# Altium project zynqEXP.PrjPCB
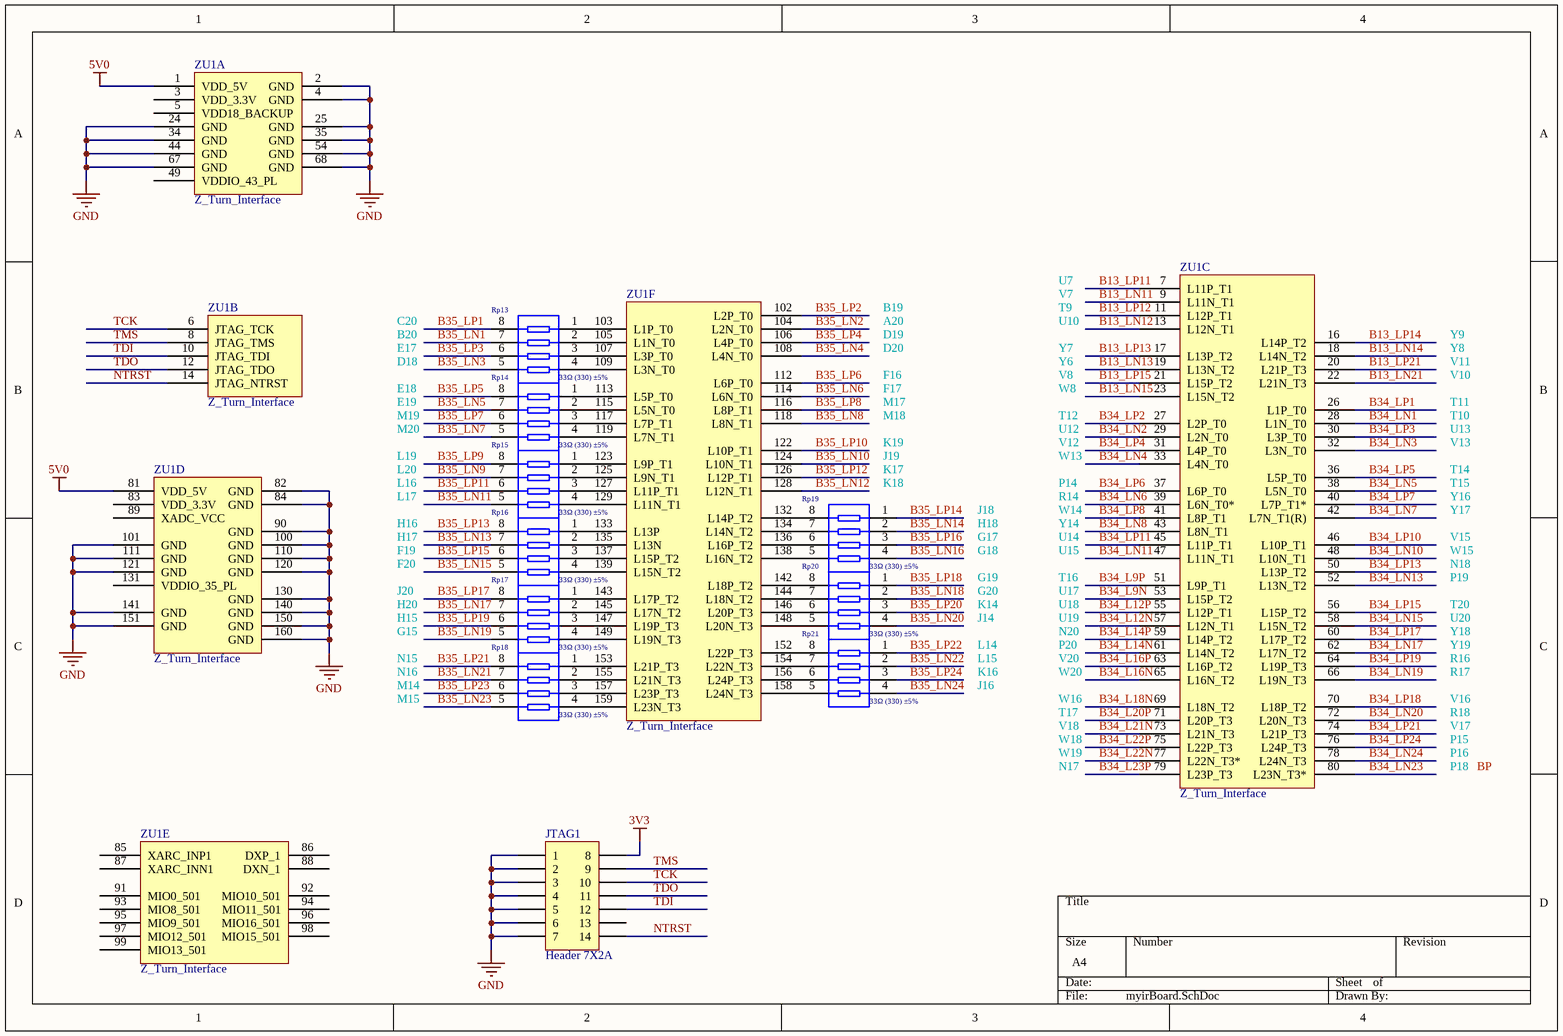
[diagram p0: myirBoard.SchDoc]
6 sheets, 92 parts. Net scope: global (net labels, ports and power ports of the same name join across sheets).
Board file: zynqEXP.PcbDoc
Sheets:
  zynqEXP.SchDoc
  myirBoard.SchDoc
  stepper.SchDoc
  protecter.SchDoc
  assistPower.SchDoc
  ITAC.SchDoc

## Sheet zynqEXP.SchDoc
size A4

## Sheet myirBoard.SchDoc
size A4

### Parts
JTAG1  Header 7X2A  [HDR2X7_CEN]
Rp13  33Ω (330) ±5%  [0402_Rx4]
Rp14  33Ω (330) ±5%  [0402_Rx4]
Rp15  33Ω (330) ±5%  [0402_Rx4]
Rp16  33Ω (330) ±5%  [0402_Rx4]
Rp17  33Ω (330) ±5%  [0402_Rx4]
Rp18  33Ω (330) ±5%  [0402_Rx4]
Rp19  33Ω (330) ±5%  [0402_Rx4]
Rp20  33Ω (330) ±5%  [0402_Rx4]
Rp21  33Ω (330) ±5%  [0402_Rx4]
ZU1  Z_Turn_Interface  [ZTURN]  (parts A,B,C,D,E,F of 6)

### Nets
3V3: JTAG1.8
5V0: ZU1.1(VDD_5V) ZU1.81(VDD_5V)
GND: JTAG1.1 JTAG1.2 JTAG1.3 JTAG1.4 JTAG1.5 JTAG1.6 JTAG1.7 ZU1.2(GND) ZU1.4(GND) ZU1.24(GND) ZU1.25(GND) ZU1.34(GND) ZU1.35(GND) ZU1.44(GND) ZU1.54(GND) ZU1.67(GND) ZU1.68(GND) ZU1.82(GND) ZU1.84(GND) ZU1.90(GND) ZU1.100(GND) ZU1.101(GND) ZU1.110(GND) ZU1.111(GND) ZU1.120(GND) ZU1.121(GND) ZU1.130(GND) ZU1.140(GND) ZU1.141(GND) ZU1.150(GND) ZU1.151(GND) ZU1.160(GND)
B13_LN11: ZU1.9(L11N_T1)
B13_LN12: ZU1.13(L12N_T1)
B13_LN13: ZU1.19(L13N_T2)
B13_LN14: ZU1.18(L14N_T2)
B13_LN15: ZU1.23(L15N_T2)
B13_LN21: ZU1.22(L21N_T3)
B13_LP11: ZU1.7(L11P_T1)
B13_LP12: ZU1.11(L12P_T1)
B13_LP13: ZU1.17(L13P_T2)
B13_LP14: ZU1.16(L14P_T2)
B13_LP15: ZU1.21(L15P_T2)
B13_LP21: ZU1.20(L21P_T3)
B34_L9N: ZU1.53(L15P_T2)
B34_L9P: ZU1.51(L9P_T1)
B34_L12N: ZU1.57(L12N_T1)
B34_L12P: ZU1.55(L12P_T1)
B34_L14N: ZU1.61(L14N_T2)
B34_L14P: ZU1.59(L14P_T2)
B34_L16N: ZU1.65(L16N_T2)
B34_L16P: ZU1.63(L16P_T2)
B34_L18N: ZU1.69(L18N_T2)
B34_L20P: ZU1.71(L20P_T3)
B34_L21N: ZU1.73(L21N_T3)
B34_L22N: ZU1.77(L22N_T3*)
B34_L22P: ZU1.75(L22P_T3)
B34_L23P: ZU1.79(L23P_T3)
B34_LN1: ZU1.28(L1N_T0)
B34_LN2: ZU1.29(L2N_T0)
B34_LN3: ZU1.32(L3N_T0)
B34_LN4: ZU1.33(L4N_T0)
B34_LN5: ZU1.38(L5N_T0)
B34_LN6: ZU1.39(L6N_T0*)
B34_LN7: ZU1.42(L7N_T1(R))
B34_LN8: ZU1.43(L8N_T1)
B34_LN10: ZU1.48(L10N_T1)
B34_LN11: ZU1.47(L11N_T1)
B34_LN13: ZU1.52(L13N_T2)
B34_LN15: ZU1.58(L15N_T2)
B34_LN17: ZU1.62(L17N_T2)
B34_LN19: ZU1.66(L19N_T3)
B34_LN20: ZU1.72(L20N_T3)
B34_LN23: ZU1.80(L23N_T3*)
B34_LN24: ZU1.78(L24N_T3)
B34_LP1: ZU1.26(L1P_T0)
B34_LP2: ZU1.27(L2P_T0)
B34_LP3: ZU1.30(L3P_T0)
B34_LP4: ZU1.31(L4P_T0)
B34_LP5: ZU1.36(L5P_T0)
B34_LP6: ZU1.37(L6P_T0)
B34_LP7: ZU1.40(L7P_T1*)
B34_LP8: ZU1.41(L8P_T1)
B34_LP10: ZU1.46(L10P_T1)
B34_LP11: ZU1.45(L11P_T1)
B34_LP13: ZU1.50(L13P_T2)
B34_LP15: ZU1.56(L15P_T2)
B34_LP17: ZU1.60(L17P_T2)
B34_LP18: ZU1.70(L18P_T2)
B34_LP19: ZU1.64(L19P_T3)
B34_LP21: ZU1.74(L21P_T3)
B34_LP24: ZU1.76(L24P_T3)
B35_LN1: Rp13.7
B35_LN2: ZU1.104(L2N_T0)
B35_LN3: Rp13.5
B35_LN4: ZU1.108(L4N_T0)
B35_LN5: Rp14.7
B35_LN6: ZU1.114(L6N_T0)
B35_LN7: Rp14.5
B35_LN8: ZU1.118(L8N_T1)
B35_LN9: Rp15.7
B35_LN10: ZU1.124(L10N_T1)
B35_LN11: Rp15.5
B35_LN12: ZU1.128(L12N_T1)
B35_LN13: Rp16.7
B35_LN14: Rp19.2
B35_LN15: Rp16.5
B35_LN16: Rp19.4
B35_LN17: Rp17.7
B35_LN18: Rp20.2
B35_LN19: Rp17.5
B35_LN20: Rp20.4
B35_LN21: Rp18.7
B35_LN22: Rp21.2
B35_LN23: Rp18.5
B35_LN24: Rp21.4
B35_LP1: Rp13.8
B35_LP2: ZU1.102(L2P_T0)
B35_LP3: Rp13.6
B35_LP4: ZU1.106(L4P_T0)
B35_LP5: Rp14.8
B35_LP6: ZU1.112(L6P_T0)
B35_LP7: Rp14.6
B35_LP8: ZU1.116(L8P_T1)
B35_LP9: Rp15.8
B35_LP10: ZU1.122(L10P_T1)
B35_LP11: Rp15.6
B35_LP12: ZU1.126(L12P_T1)
B35_LP13: Rp16.8
B35_LP14: Rp19.1
B35_LP15: Rp16.6
B35_LP16: Rp19.3
B35_LP17: Rp17.8
B35_LP18: Rp20.1
B35_LP19: Rp17.6
B35_LP20: Rp20.3
B35_LP21: Rp18.8
B35_LP22: Rp21.1
B35_LP23: Rp18.6
B35_LP24: Rp21.3
NTRST: JTAG1.14 ZU1.14(JTAG_NTRST)
TCK: JTAG1.10 ZU1.6(JTAG_TCK)
TDI: JTAG1.12 ZU1.10(JTAG_TDI)
TDO: JTAG1.11 ZU1.12(JTAG_TDO)
TMS: JTAG1.9 ZU1.8(JTAG_TMS)
NetRp13_1: Rp13.1 ZU1.103(L1P_T0)
NetRp13_2: Rp13.2 ZU1.105(L1N_T0)
NetRp13_3: Rp13.3 ZU1.107(L3P_T0)
NetRp13_4: Rp13.4 ZU1.109(L3N_T0)
NetRp14_1: Rp14.1 ZU1.113(L5P_T0)
NetRp14_2: Rp14.2 ZU1.115(L5N_T0)
NetRp14_3: Rp14.3 ZU1.117(L7P_T1)
NetRp14_4: Rp14.4 ZU1.119(L7N_T1)
NetRp15_1: Rp15.1 ZU1.123(L9P_T1)
NetRp15_2: Rp15.2 ZU1.125(L9N_T1)
NetRp15_3: Rp15.3 ZU1.127(L11P_T1)
NetRp15_4: Rp15.4 ZU1.129(L11N_T1)
NetRp16_1: Rp16.1 ZU1.133(L13P)
NetRp16_2: Rp16.2 ZU1.135(L13N)
NetRp16_3: Rp16.3 ZU1.137(L15P_T2)
NetRp16_4: Rp16.4 ZU1.139(L15N_T2)
NetRp17_1: Rp17.1 ZU1.143(L17P_T2)
NetRp17_2: Rp17.2 ZU1.145(L17N_T2)
NetRp17_3: Rp17.3 ZU1.147(L19P_T3)
NetRp17_4: Rp17.4 ZU1.149(L19N_T3)
NetRp18_1: Rp18.1 ZU1.153(L21P_T3)
NetRp18_2: Rp18.2 ZU1.155(L21N_T3)
NetRp18_3: Rp18.3 ZU1.157(L23P_T3)
NetRp18_4: Rp18.4 ZU1.159(L23N_T3)
NetRp19_5: Rp19.5 ZU1.138(L16N_T2)
NetRp19_6: Rp19.6 ZU1.136(L16P_T2)
NetRp19_7: Rp19.7 ZU1.134(L14N_T2)
NetRp19_8: Rp19.8 ZU1.132(L14P_T2)
NetRp20_5: Rp20.5 ZU1.148(L20N_T3)
NetRp20_6: Rp20.6 ZU1.146(L20P_T3)
NetRp20_7: Rp20.7 ZU1.144(L18N_T2)
NetRp20_8: Rp20.8 ZU1.142(L18P_T2)
NetRp21_5: Rp21.5 ZU1.158(L24N_T3)
NetRp21_6: Rp21.6 ZU1.156(L24P_T3)
NetRp21_7: Rp21.7 ZU1.154(L22N_T3)
NetRp21_8: Rp21.8 ZU1.152(L22P_T3)

Not connected (* = marked no-connect by the designer): JTAG1 13; ZU1 3(VDD_3.3V) 5(VDD18_BACKUP) 49(VDDIO_43_PL) 83(VDD_3.3V) 85(XARC_INP1) 86(DXP_1) 87(XARC_INN1) 88(DXN_1) 89(XADC_VCC) 91(MIO0_501) 92(MIO10_501) 93(MIO8_501) 94(MIO11_501) 95(MIO9_501) 96(MIO16_501) 97(MIO12_501) 98(MIO15_501) 99(MIO13_501) 131(VDDIO_35_PL)

### Notes on the sheet
- Labels drawn without touching a wire or pin: A20, B19, B20, BP, C20, D18, D19, D20, E17, E18, E19, F16, F17, F19, F20, G15, G17, G18, G19, G20, H15, H16, H17, H18, H20, J14, J16, J18, J19, J20, K14, K16, K17, K18, K19, L14, L15, L16, L17, L19, L20, M14, M15, M17, M18, M19, M20, N15, N16, N17, N18, N20, P14, P15, P16, P18, P19, P20, R14, R16, R17, R18, T9, T10, T11, T12, T14, T15, T16, T17, T20, U7, U10, U12, U13, U14, U15, U17, U18, U19, U20, V7, V8, V10, V11, V12, V13, V15, V16, V17, V18, V20, W8, W13, W14, W15, W16, W18, W19, W20, Y6, Y7, Y8, Y9, Y14, Y16, Y17, Y18, Y19

### Library data of the parts
JTAG1 = Header 7X2A: Header, 7-Pin, Dual row; LatestRevisionDate: 17-Jul-2002; LatestRevisionNote: Re-released for DXP Platform.; Publisher: Altium Limited
Rp13-Rp21 = 0402*4 33Ω (330) 5%: 贴片排阻; ComponentLink1Description: 供应商链接; ComponentLink1URL: http://www.szlcsc.com/product/details_26244.html; Package: 0402*4; Supplier: LC; SuppliersPartNumber: C25501

## Sheet stepper.SchDoc
size A3
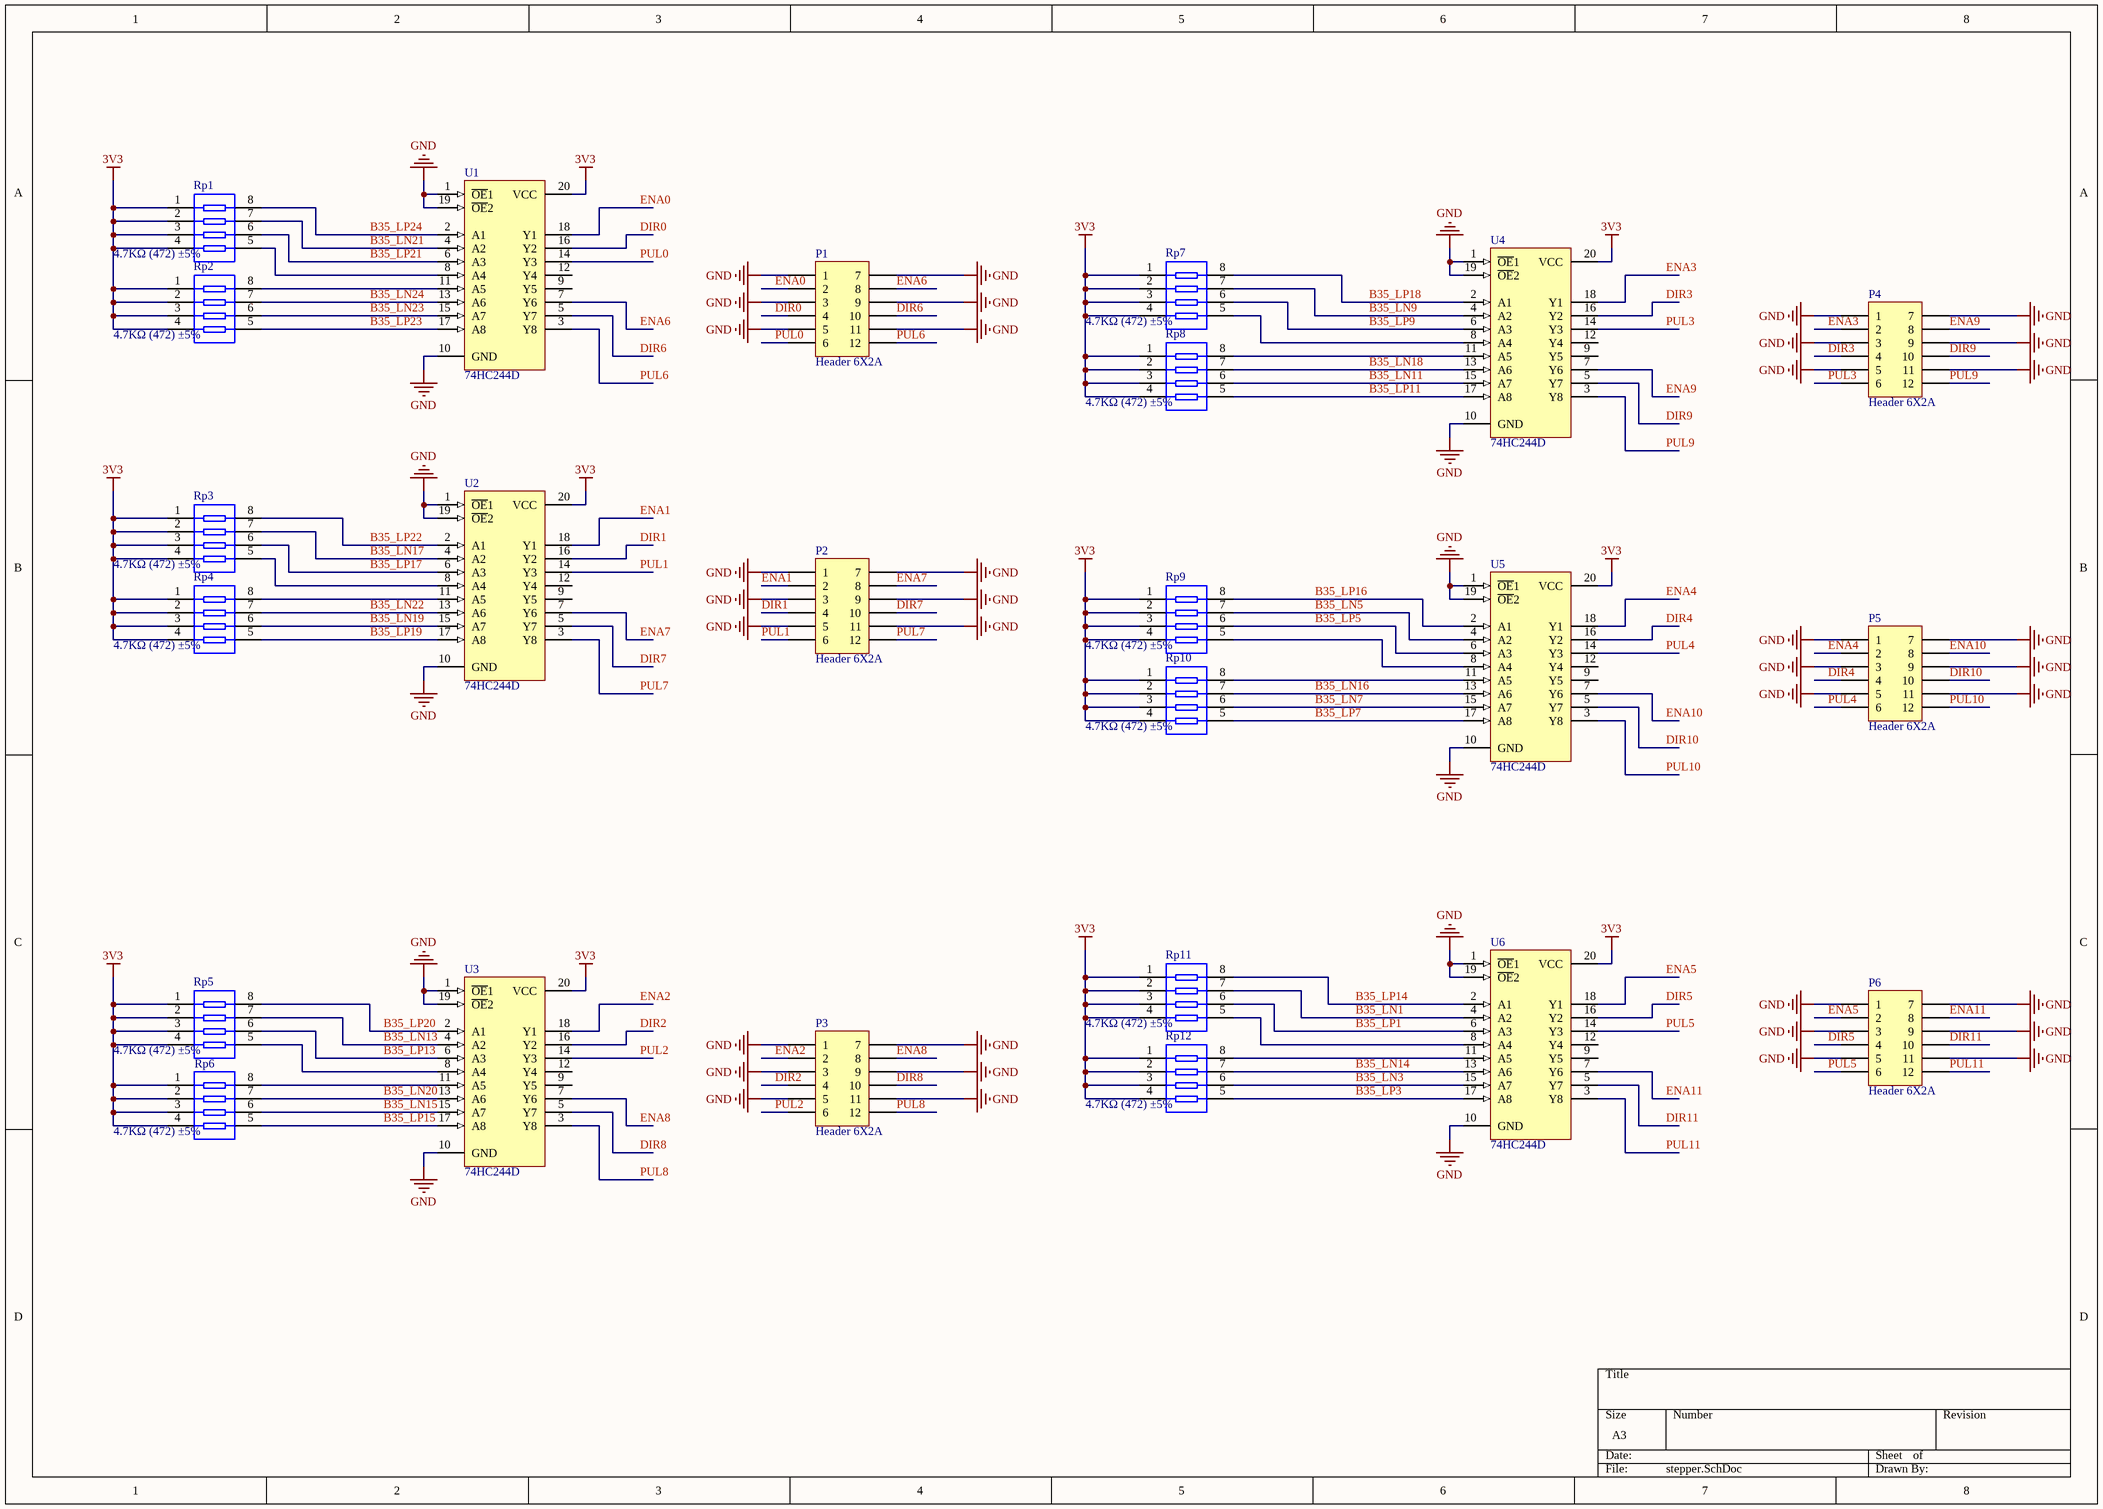
[diagram p1: stepper.SchDoc]

### Parts
P1  Header 6X2A  [2EDG-3.81-06P*2 - duplicate]
P2  Header 6X2A  [2EDG-3.81-06P*2 - duplicate]
P3  Header 6X2A  [2EDG-3.81-06P*2 - duplicate]
P4  Header 6X2A  [2EDG-3.81-06P*2 - duplicate]
P5  Header 6X2A  [2EDG-3.81-06P*2 - duplicate]
P6  Header 6X2A  [2EDG-3.81-06P*2 - duplicate]
Rp1  4.7KΩ (472) ±5%  [0603_Rx4]
Rp2  4.7KΩ (472) ±5%  [0603_Rx4]
Rp3  4.7KΩ (472) ±5%  [0603_Rx4]
Rp4  4.7KΩ (472) ±5%  [0603_Rx4]
Rp5  4.7KΩ (472) ±5%  [0603_Rx4]
Rp6  4.7KΩ (472) ±5%  [0603_Rx4]
Rp7  4.7KΩ (472) ±5%  [0603_Rx4]
Rp8  4.7KΩ (472) ±5%  [0603_Rx4]
Rp9  4.7KΩ (472) ±5%  [0603_Rx4]
Rp10  4.7KΩ (472) ±5%  [0603_Rx4]
Rp11  4.7KΩ (472) ±5%  [0603_Rx4]
Rp12  4.7KΩ (472) ±5%  [0603_Rx4]
U1  74HC244D  [SOIC-20_300mil]
U2  74HC244D  [SOIC-20_300mil]
U3  74HC244D  [SOIC-20_300mil]
U4  74HC244D  [SOIC-20_300mil]
U5  74HC244D  [SOIC-20_300mil]
U6  74HC244D  [SOIC-20_300mil]

### Nets
3V3: Rp1.1 Rp1.2 Rp1.3 Rp1.4 Rp2.1 Rp2.2 Rp2.3 Rp2.4 Rp3.1 Rp3.2 Rp3.3 Rp3.4 Rp4.1 Rp4.2 Rp4.3 Rp4.4 Rp5.1 Rp5.2 Rp5.3 Rp5.4 Rp6.1 Rp6.2 Rp6.3 Rp6.4 Rp7.1 Rp7.2 Rp7.3 Rp7.4 Rp8.1 Rp8.2 Rp8.3 Rp8.4 Rp9.1 Rp9.2 Rp9.3 Rp9.4 Rp10.1 Rp10.2 Rp10.3 Rp10.4 Rp11.1 Rp11.2 Rp11.3 Rp11.4 Rp12.1 Rp12.2 Rp12.3 Rp12.4 U1.20(VCC) U2.20(VCC) U3.20(VCC) U4.20(VCC) U5.20(VCC) U6.20(VCC)
GND: P1.1 P1.3 P1.5 P1.7 P1.9 P1.11 P2.1 P2.3 P2.5 P2.7 P2.9 P2.11 P3.1 P3.3 P3.5 P3.7 P3.9 P3.11 P4.1 P4.3 P4.5 P4.7 P4.9 P4.11 P5.1 P5.3 P5.5 P5.7 P5.9 P5.11 P6.1 P6.3 P6.5 P6.7 P6.9 P6.11 U1.1(~{OE}1) U1.10(GND) U1.19(~{OE}2) U2.1(~{OE}1) U2.10(GND) U2.19(~{OE}2) U3.1(~{OE}1) U3.10(GND) U3.19(~{OE}2) U4.1(~{OE}1) U4.10(GND) U4.19(~{OE}2) U5.1(~{OE}1) U5.10(GND) U5.19(~{OE}2) U6.1(~{OE}1) U6.10(GND) U6.19(~{OE}2)
B35_LN1: Rp11.7 U6.4(A2)
B35_LN3: Rp12.6 U6.15(A7)
B35_LN5: Rp9.7 U5.4(A2)
B35_LN7: Rp10.6 U5.15(A7)
B35_LN9: Rp7.7 U4.4(A2)
B35_LN11: Rp8.6 U4.15(A7)
B35_LN13: Rp5.7 U3.4(A2)
B35_LN14: Rp12.7 U6.13(A6)
B35_LN15: Rp6.6 U3.15(A7)
B35_LN16: Rp10.7 U5.13(A6)
B35_LN17: Rp3.7 U2.4(A2)
B35_LN18: Rp8.7 U4.13(A6)
B35_LN19: Rp4.6 U2.15(A7)
B35_LN20: Rp6.7 U3.13(A6)
B35_LN21: Rp1.7 U1.4(A2)
B35_LN22: Rp4.7 U2.13(A6)
B35_LN23: Rp2.6 U1.15(A7)
B35_LN24: Rp2.7 U1.13(A6)
B35_LP1: Rp11.6 U6.6(A3)
B35_LP3: Rp12.5 U6.17(A8)
B35_LP5: Rp9.6 U5.6(A3)
B35_LP7: Rp10.5 U5.17(A8)
B35_LP9: Rp7.6 U4.6(A3)
B35_LP11: Rp8.5 U4.17(A8)
B35_LP13: Rp5.6 U3.6(A3)
B35_LP14: Rp11.8 U6.2(A1)
B35_LP15: Rp6.5 U3.17(A8)
B35_LP16: Rp9.8 U5.2(A1)
B35_LP17: Rp3.6 U2.6(A3)
B35_LP18: Rp7.8 U4.2(A1)
B35_LP19: Rp4.5 U2.17(A8)
B35_LP20: Rp5.8 U3.2(A1)
B35_LP21: Rp1.6 U1.6(A3)
B35_LP22: Rp3.8 U2.2(A1)
B35_LP23: Rp2.5 U1.17(A8)
B35_LP24: Rp1.8 U1.2(A1)
DIR0: P1.4 U1.16(Y2)
DIR1: P2.4 U2.16(Y2)
DIR2: P3.4 U3.16(Y2)
DIR3: P4.4 U4.16(Y2)
DIR4: P5.4 U5.16(Y2)
DIR5: P6.4 U6.16(Y2)
DIR6: P1.10 U1.5(Y7)
DIR7: P2.10 U2.5(Y7)
DIR8: P3.10 U3.5(Y7)
DIR9: P4.10 U4.5(Y7)
DIR10: P5.10 U5.5(Y7)
DIR11: P6.10 U6.5(Y7)
ENA0: P1.2 U1.18(Y1)
ENA1: P2.2 U2.18(Y1)
ENA2: P3.2 U3.18(Y1)
ENA3: P4.2 U4.18(Y1)
ENA4: P5.2 U5.18(Y1)
ENA5: P6.2 U6.18(Y1)
ENA6: P1.8 U1.7(Y6)
ENA7: P2.8 U2.7(Y6)
ENA8: P3.8 U3.7(Y6)
ENA9: P4.8 U4.7(Y6)
ENA10: P5.8 U5.7(Y6)
ENA11: P6.8 U6.7(Y6)
PUL0: P1.6 U1.14(Y3)
PUL1: P2.6 U2.14(Y3)
PUL2: P3.6 U3.14(Y3)
PUL3: P4.6 U4.14(Y3)
PUL4: P5.6 U5.14(Y3)
PUL5: P6.6 U6.14(Y3)
PUL6: P1.12 U1.3(Y8)
PUL7: P2.12 U2.3(Y8)
PUL8: P3.12 U3.3(Y8)
PUL9: P4.12 U4.3(Y8)
PUL10: P5.12 U5.3(Y8)
PUL11: P6.12 U6.3(Y8)
NetRp1_5: Rp1.5 U1.8(A4)
NetRp2_8: Rp2.8 U1.11(A5)
NetRp3_5: Rp3.5 U2.8(A4)
NetRp4_8: Rp4.8 U2.11(A5)
NetRp5_5: Rp5.5 U3.8(A4)
NetRp6_8: Rp6.8 U3.11(A5)
NetRp7_5: Rp7.5 U4.8(A4)
NetRp8_8: Rp8.8 U4.11(A5)
NetRp9_5: Rp9.5 U5.8(A4)
NetRp10_8: Rp10.8 U5.11(A5)
NetRp11_5: Rp11.5 U6.8(A4)
NetRp12_8: Rp12.8 U6.11(A5)

Not connected (* = marked no-connect by the designer): U1 9(Y5) 12(Y4); U2 9(Y5) 12(Y4); U3 9(Y5) 12(Y4); U4 9(Y5) 12(Y4); U5 9(Y5) 12(Y4); U6 9(Y5) 12(Y4)

### Library data of the parts
P1-P6 = Header 6X2A: Header, 6-Pin, Dual row; LatestRevisionDate: 17-Jul-2002; LatestRevisionNote: Re-released for DXP Platform.; Publisher: Altium Limited
Rp1-Rp12 = 0603*4  4.7KΩ (472) 5%: 贴片排阻; ComponentLink1Description: 供应商链接; ComponentLink1URL: http://www.szlcsc.com/product/details_2332.html; Package: 0603*4; Supplier: LC; SuppliersPartNumber: C1980
U1-U6 = 74HC244D_[C5622]: 74系列逻辑芯片; ComponentLink1Description: 供应商链接; ComponentLink1URL: http://www.szlcsc.com/product/details_6073.html; Package: SOIC-20_300mil; Supplier: LC; SuppliersPartNumber: C5622

## Sheet protecter.SchDoc
size A4
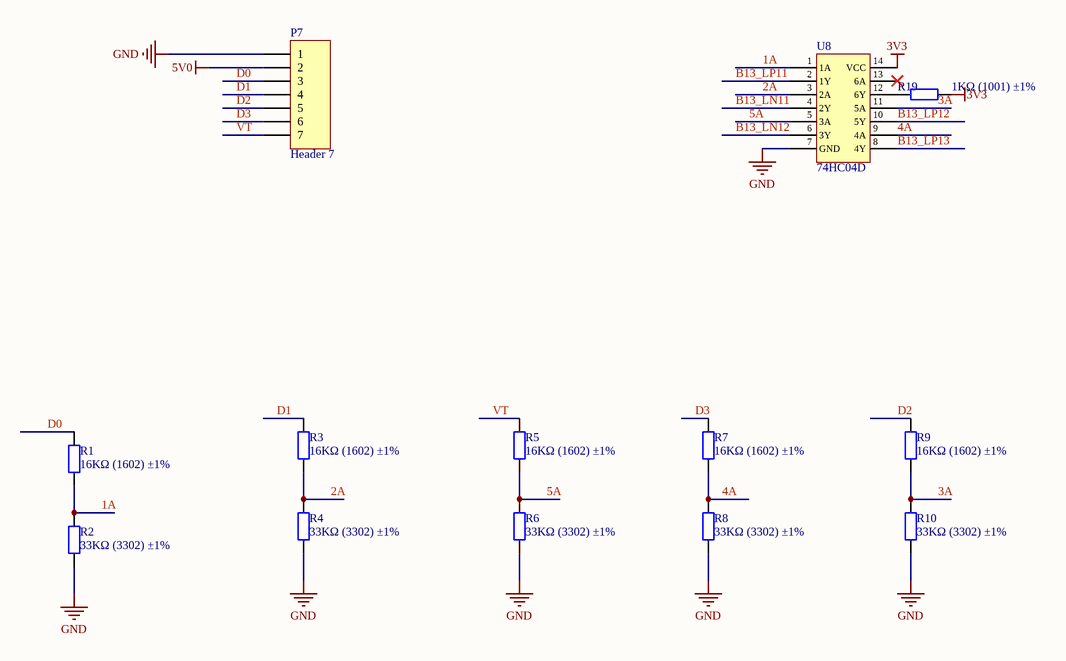
[diagram p2: protecter.SchDoc]

### Parts
P7  Header 7  [HDR1X7]
R1  16KΩ (1602) ±1%  [0603_R]
R2  33KΩ (3302) ±1%  [0402_R]
R3  16KΩ (1602) ±1%  [0603_R]
R4  33KΩ (3302) ±1%  [0402_R]
R5  16KΩ (1602) ±1%  [0603_R]
R6  33KΩ (3302) ±1%  [0402_R]
R7  16KΩ (1602) ±1%  [0603_R]
R8  33KΩ (3302) ±1%  [0402_R]
R9  16KΩ (1602) ±1%  [0603_R]
R10  33KΩ (3302) ±1%  [0402_R]
R19  1KΩ (1001) ±1%  [0402_R]
U8  74HC04D  [SOIC-14_150mil]

### Nets
3V3: R19.2 U8.14(VCC)
5V0: P7.2
GND: P7.1 R2.1 R4.1 R6.1 R8.1 R10.1 U8.7(GND)
1A: R1.1 R2.2 U8.1(1A)
2A: R3.1 R4.2 U8.3(2A)
3A: R9.1 R10.2 U8.11(5A)
4A: R7.1 R8.2 U8.9(4A)
5A: R5.1 R6.2 U8.5(3A)
B13_LN11: U8.4(2Y)
B13_LN12: U8.6(3Y)
B13_LP11: U8.2(1Y)
B13_LP12: U8.10(5Y)
B13_LP13: U8.8(4Y)
D0: P7.3 R1.2
D1: P7.4 R3.2
D2: P7.5 R9.2
D3: P7.6 R7.2
VT: P7.7 R5.2
NetR19_1: R19.1 U8.12(6Y)

Not connected (* = marked no-connect by the designer): U8 13(6A)*

### Library data of the parts
P7 = Header 7: Header, 7-Pin; LatestRevisionDate: 17-Jul-2002; LatestRevisionNote: Re-released for DXP Platform.; Publisher: Altium Limited
R1 R3 R5 R7 R9 = 0603 16KΩ (1602) 1%: 贴片电阻; ComponentLink1Description: 供应商链接; ComponentLink1URL: http://www.szlcsc.com/product/details_23545.html; Package: 0603; Supplier: LC; SuppliersPartNumber: C22818
R2 R4 R6 R8 R10 = 0402 33KΩ (3302) 1%: 贴片电阻; ComponentLink1Description: 供应商链接; ComponentLink1URL: http://www.szlcsc.com/product/details_26522.html; Package: 0402; Supplier: LC; SuppliersPartNumber: C25779
R19 = 0402 1KΩ (1001) 1%: 贴片电阻; ComponentLink1Description: 供应商链接; ComponentLink1URL: http://www.szlcsc.com/product/details_12256.html; Package: 0402; Supplier: LC; SuppliersPartNumber: C11702

## Sheet assistPower.SchDoc
size A4
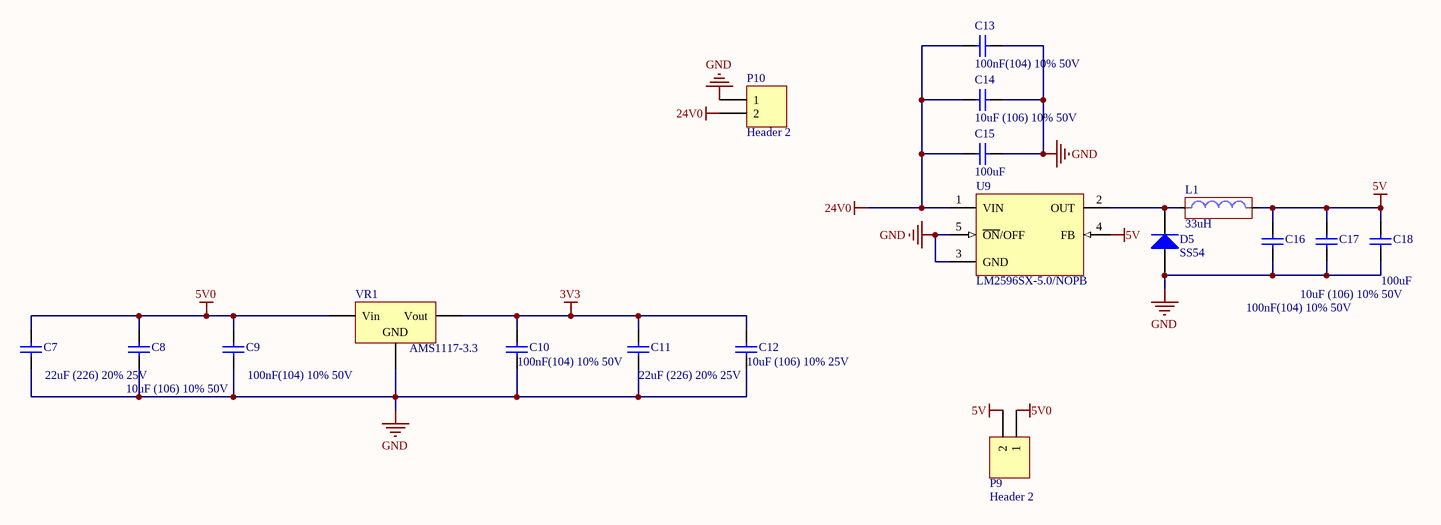
[diagram p3: assistPower.SchDoc]

### Parts
C7  22uF (226) 20% 25V  [0805_C]
C8  10uF (106) 10% 50V  [1206_C]
C9  100nF(104) 10% 50V  [0805_C]
C10  100nF(104) 10% 50V  [0805_C]
C11  22uF (226) 20% 25V  [0805_C]
C12  10uF (106) 10% 25V  [0805_C]
C13  100nF(104) 10% 50V  [0805_C]
C14  10uF (106) 10% 50V  [1206_C]
C15  value 100uF  [C100uF]  (hidden comment: Cap)
C16  100nF(104) 10% 50V  [0805_C]
C17  10uF (106) 10% 50V  [1206_C]
C18  value 100uF  [C100uF]  (hidden comment: Cap)
D5  SS54  [SMA(DO-214AC)_S1]
L1  33uH  [L-SMD-7]
P9  Header 2  [HDR1X2]
P10  Header 2  [5.08-2P]
U9  LM2596SX-5.0/NOPB  [TO-263-5]
VR1  AMS1117-3.3  [SOT-223]

### Nets
3V3: C10.2 C11.2 C12.2 VR1.2(Vout)
5V: C16.2 C17.2 C18.1 L1.1 P9.2 U9.4(FB)
5V0: C7.2 C8.2 C9.2 P9.1 VR1.3(Vin)
24V0: C13.1 C14.1 C15.2 P10.2 U9.1(VIN)
GND: C7.1 C8.1 C9.1 C10.1 C11.1 C12.1 C13.2 C14.2 C15.1 C16.1 C17.1 C18.2 D5.1(A) P10.1 U9.3(GND) U9.5(~{ON}/OFF) VR1.1(GND)
NetD5_2: D5.2(K) L1.2 U9.2(OUT)

### Library data of the parts
C7 C11 = 0805 22uF (226) 20% 25V: 贴片电容; ComponentLink1Description: 供应商链接; ComponentLink1URL: http://www.szlcsc.com/product/details_46786.html; Package: 0805; Supplier: LC; SuppliersPartNumber: C45783
C8 C14 C17 = 1206 10uF (106) 10% 50V: 贴片电容; ComponentLink1Description: 供应商链接; ComponentLink1URL: http://www.szlcsc.com/product/details_14236.html; Package: 1206; Supplier: LC; SuppliersPartNumber: C13585
C9 C10 C13 C16 = 0805 100nF(104) 10% 50V: 贴片电容; ComponentLink1Description: 供应商链接; ComponentLink1URL: http://www.szlcsc.com/product/details_50686.html; Package: 0805; Supplier: LC; SuppliersPartNumber: C49678
C12 = 0805 10uF (106) 10% 25V: 贴片电容; ComponentLink1Description: 供应商链接; ComponentLink1URL: http://www.szlcsc.com/product/details_16532.html; Package: 0805; Supplier: LC; SuppliersPartNumber: C15850
C15 C18 = Cap: 贴片电容; Published: 8-Jun-2000; LatestRevisionDate: 17-Jul-2002; LatestRevisionNote: Re-released for DXP Platform.; PackageReference: RAD-0.3; Publisher: Altium Limited
D5 = SMA(DO-214AC) SS54: 二极管; ComponentLink1Description: 供应商链接; ComponentLink1URL: http://www.szlcsc.com/product/details_23178.html; Package: SMA(DO-214AC); Supplier: LC; SuppliersPartNumber: C22452
L1 = Inductor
P9 P10 = Header 2: Header, 2-Pin; LatestRevisionDate: 17-Jul-2002; LatestRevisionNote: Re-released for DXP Platform.; Publisher: Altium Limited
U9 = LM2596SX-5.0/NOPB_[C10002]: DC-DC芯片; ComponentLink1Description: 供应商链接; ComponentLink1URL: http://www.szlcsc.com/product/details_10538.html; Package: TO-263-5; Supplier: LC; SuppliersPartNumber: C10002
VR1 = SOT-223 AMS1117-3.3: 低压差线性稳压(LDO); ComponentLink1Description: 供应商链接; ComponentLink1URL: http://www.szlcsc.com/product/details_6652.html; Package: SOT-223; Supplier: LC; SuppliersPartNumber: C6186

## Sheet ITAC.SchDoc
size A4
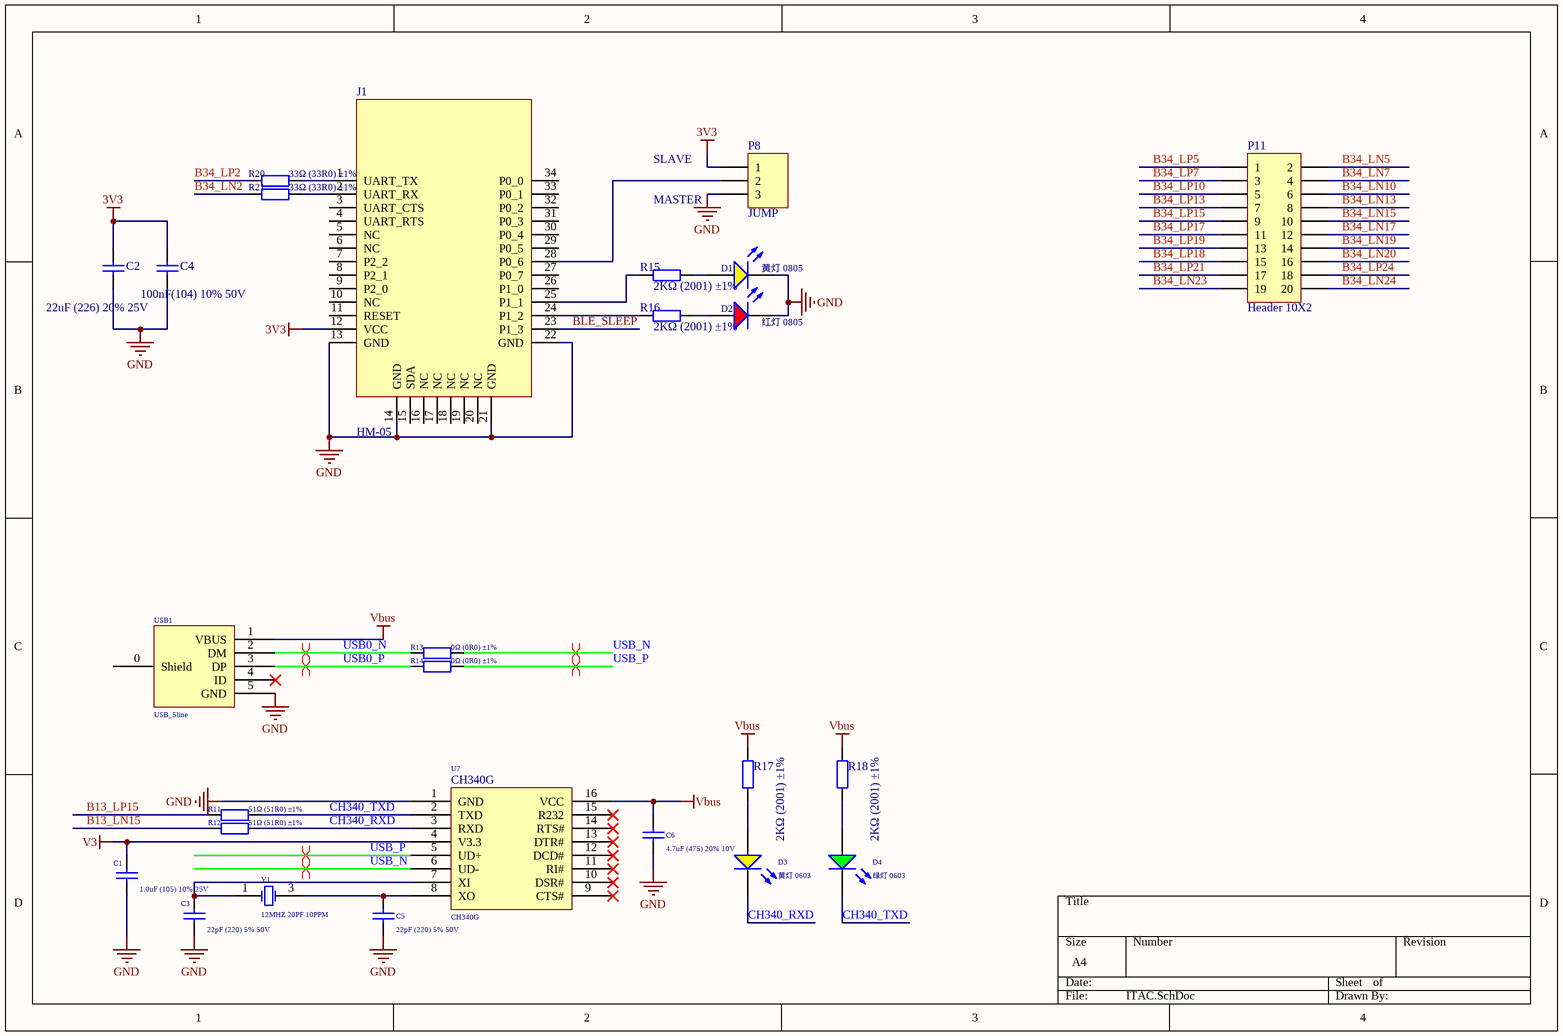
[diagram p4: ITAC.SchDoc]

### Parts
C1  1.0uF (105) 10% 25V  [0402_C]
C2  22uF (226) 20% 25V  [0805_C]
C3  22pF (220) 5% 50V  [0402_C]
C4  100nF(104) 10% 50V  [0805_C]
C5  22pF (220) 5% 50V  [0402_C]
C6  4.7uF (475) 20% 10V  [0402_C]
D1  黄灯 0805  [0805_LED_S1]
D2  红灯 0805  [0805_LED_S1]
D3  黄灯 0603  [0603_LED_S1]
D4  绿灯 0603  [0603_LED_S1]
J1  HM-05  [BT05]
P8  JUMP  [HDR1X3]
P11  Header 10X2  [HDR2X10]
R11  51Ω (51R0) ±1%  [0402_R]
R12  51Ω (51R0) ±1%  [0402_R]
R13  0Ω (0R0) ±1%  [0402_R]
R14  0Ω (0R0) ±1%  [0402_R]
R15  2KΩ (2001) ±1%  [0805_R]
R16  2KΩ (2001) ±1%  [0805_R]
R17  2KΩ (2001) ±1%  [0402_R]
R18  2KΩ (2001) ±1%  [0402_R]
R20  33Ω (33R0) ±1%  [0402_R]
R21  33Ω (33R0) ±1%  [0402_R]
U7  CH340G  [SOIC-16_150mil]
USB1  USB_5line  [USB-MICRO-5P-2F]
Y1  12MHZ 20PF 10PPM  [SMD-3225_4P]

### Nets
3V3: C2.2 C4.2 J1.12(VCC) P8.1
GND: C1.1 C2.1 C3.1 C4.1 C5.1 C6.1 D1.K D2.K J1.13(GND) J1.14(GND) J1.21(GND) J1.22(GND) P8.3 U7.1(GND) USB1.5(GND)
V3: C1.2 U7.4(V3.3)
Vbus: C6.2 R17.2 R18.1 U7.16(VCC) USB1.1(VBUS)
B13_LN15: R12.1
B13_LP15: R11.1
B34_LN2: R21.1
B34_LN5: P11.2
B34_LN7: P11.4
B34_LN10: P11.6
B34_LN13: P11.8
B34_LN15: P11.10
B34_LN17: P11.12
B34_LN19: P11.14
B34_LN20: P11.16
B34_LN23: P11.19
B34_LN24: P11.20
B34_LP2: R20.1
B34_LP5: P11.1
B34_LP7: P11.3
B34_LP10: P11.5
B34_LP13: P11.7
B34_LP15: P11.9
B34_LP17: P11.11
B34_LP18: P11.15
B34_LP19: P11.13
B34_LP21: P11.17
B34_LP24: P11.18
BLE_SLEEP: J1.23(P1_3)
CH340_RXD: D3.K R12.2 U7.3(RXD)
CH340_TXD: D4.K R11.2 U7.2(TXD)
USB0_N: R13.1 USB1.2(DM)
USB0_P: R14.1 USB1.3(DP)
USB_N: R13.2 U7.6(UD-)
USB_P: R14.2 U7.5(UD+)
NetC3_2: C3.2 U7.7(XI) Y1.1(OSC1)
NetC5_2: C5.2 U7.8(XO) Y1.3(OSC2)
NetD1_A: D1.A R15.2
NetD2_A: D2.A R16.2
NetD3_A: D3.A R17.1
NetD4_A: D4.A R18.2
NetJ1_1: J1.1(UART_TX) R20.2
NetJ1_2: J1.2(UART_RX) R21.2
NetJ1_24: J1.24(P1_2) R16.1
NetJ1_25: J1.25(P1_1) R15.1
NetJ1_28: J1.28(P0_6) P8.2

Not connected (* = marked no-connect by the designer): J1 3(UART_CTS) 4(UART_RTS) 5(NC) 6(NC) 7(P2_2) 8(P2_1) 9(P2_0) 10(NC) 11(RESET) 15(SDA) 16(NC) 17(NC) 18(NC) 19(NC) 20(NC) 26(P1_0) 27(P0_7) 29(P0_5) 30(P0_4) 31(P0_3) 32(P0_2) 33(P0_1) 34(P0_0); U7 9(CTS#)* 10(DSR#)* 11(RI#)* 12(DCD#)* 13(DTR#)* 14(RTS#)* 15(R232)*; USB1 0(Shield) 4(ID)*

### Layout directives
differential pair: USB0_N, USB0_P, USB_N, USB_P

### Notes on the sheet
- SLAVE
- MASTER

### Library data of the parts
C1 = 0402 1.0uF (105) 10% 25V: 贴片电容; ComponentLink1Description: 供应商链接; ComponentLink1URL: http://www.szlcsc.com/product/details_53938.html; Package: 0402; Supplier: LC; SuppliersPartNumber: C52923
C2 = 0805 22uF (226) 20% 25V: 贴片电容; ComponentLink1Description: 供应商链接; ComponentLink1URL: http://www.szlcsc.com/product/details_46786.html; Package: 0805; Supplier: LC; SuppliersPartNumber: C45783
C3 C5 = 0402 22pF (220) 5% 50V: 贴片电容; ComponentLink1Description: 供应商链接; ComponentLink1URL: http://www.szlcsc.com/product/details_1907.html; Package: 0402; Supplier: LC; SuppliersPartNumber: C1555
C4 = 0805 100nF(104) 10% 50V: 贴片电容; ComponentLink1Description: 供应商链接; ComponentLink1URL: http://www.szlcsc.com/product/details_50686.html; Package: 0805; Supplier: LC; SuppliersPartNumber: C49678
C6 = 0402 4.7uF (475) 20% 10V: 贴片电容; ComponentLink1Description: 供应商链接; ComponentLink1URL: http://www.szlcsc.com/product/details_24469.html; Package: 0402; Supplier: LC; SuppliersPartNumber: C23733
D1 = 0805 黄灯: 发光二极管; ComponentLink1Description: 供应商链接; ComponentLink1URL: http://www.szlcsc.com/product/details_2669.html; Package: 0805; Supplier: LC; SuppliersPartNumber: C2296
D2 = 0805 红灯: 发光二极管; ComponentLink1Description: 供应商链接; ComponentLink1URL: http://www.szlcsc.com/product/details_2668.html; Package: 0805; Supplier: LC; SuppliersPartNumber: C2295
D3 = 0603 黄灯: 发光二极管; ComponentLink1Description: 供应商链接; ComponentLink1URL: http://www.szlcsc.com/product/details_73147.html; Package: 0603; Supplier: LC; SuppliersPartNumber: C72038
D4 = 0603 绿灯: 发光二极管; ComponentLink1Description: 供应商链接; ComponentLink1URL: http://www.szlcsc.com/product/details_73152.html; Package: 0603; Supplier: LC; SuppliersPartNumber: C72043
P8 = Header 3: Header, 3-Pin; LatestRevisionDate: 17-Jul-2002; LatestRevisionNote: Re-released for DXP Platform.; Publisher: Altium Limited
P11 = Header 10X2: Header, 10-Pin, Dual row; LatestRevisionDate: 17-Jul-2002; LatestRevisionNote: Re-released for DXP Platform.; Publisher: Altium Limited
R11 R12 = 0402 51Ω (51R0) 1%: 贴片电阻; ComponentLink1Description: 供应商链接; ComponentLink1URL: http://www.szlcsc.com/product/details_25868.html; Package: 0402; Supplier: LC; SuppliersPartNumber: C25125
R13 R14 = 0402 0Ω (0R0) 1%: 贴片电阻; ComponentLink1Description: 供应商链接; ComponentLink1URL: http://www.szlcsc.com/product/details_17853.html; Package: 0402; Supplier: LC; SuppliersPartNumber: C17168
R15 R16 = 0805 2KΩ (2001) 1%: 贴片电阻; ComponentLink1Description: 供应商链接; ComponentLink1URL: http://www.szlcsc.com/product/details_18292.html; Package: 0805; Supplier: LC; SuppliersPartNumber: C17604
R17 R18 = 0402 2KΩ (2001) 1%: 贴片电阻; ComponentLink1Description: 供应商链接; ComponentLink1URL: http://www.szlcsc.com/product/details_4516.html; Package: 0402; Supplier: LC; SuppliersPartNumber: C4109
R20 R21 = 0402 33Ω (33R0) 1%: 贴片电阻; ComponentLink1Description: 供应商链接; ComponentLink1URL: http://www.szlcsc.com/product/details_25848.html; Package: 0402; Supplier: LC; SuppliersPartNumber: C25105
U7 = CH340G_[C14267]: USB; ComponentLink1Description: 供应商链接; ComponentLink1URL: http://www.szlcsc.com/product/details_14927.html; Package: SOIC-16_150mil; Supplier: LC; SuppliersPartNumber: C14267
Y1 = SMD-3225_4P  12MHZ 20PF 10PPM: 贴片晶振; ComponentLink1Description: 供应商链接; ComponentLink1URL: http://www.szlcsc.com/product/details_9522.html; Package: SMD-3225_4P; Supplier: LC; SuppliersPartNumber: C9002

## Nets that join several sheets
3V3: myirBoard (JTAG1.8), stepper (54 pins), protecter (R19.2 U8.14), assistPower (C10.2 C11.2 C12.2 VR1.2), ITAC (C2.2 C4.2 J1.12 P8.1)
5V0: myirBoard (ZU1.1 ZU1.81), protecter (P7.2), assistPower (5 pins)
GND: myirBoard (32 pins), stepper (54 pins), protecter (7 pins), assistPower (17 pins), ITAC (15 pins)
B13_LN11: myirBoard (ZU1.9), protecter (U8.4)
B13_LN12: myirBoard (ZU1.13), protecter (U8.6)
B13_LN15: myirBoard (ZU1.23), ITAC (R12.1)
B13_LP11: myirBoard (ZU1.7), protecter (U8.2)
B13_LP12: myirBoard (ZU1.11), protecter (U8.10)
B13_LP13: myirBoard (ZU1.17), protecter (U8.8)
B13_LP15: myirBoard (ZU1.21), ITAC (R11.1)
B34_LN2: myirBoard (ZU1.29), ITAC (R21.1)
B34_LN5: myirBoard (ZU1.38), ITAC (P11.2)
B34_LN7: myirBoard (ZU1.42), ITAC (P11.4)
B34_LN10: myirBoard (ZU1.48), ITAC (P11.6)
B34_LN13: myirBoard (ZU1.52), ITAC (P11.8)
B34_LN15: myirBoard (ZU1.58), ITAC (P11.10)
B34_LN17: myirBoard (ZU1.62), ITAC (P11.12)
B34_LN19: myirBoard (ZU1.66), ITAC (P11.14)
B34_LN20: myirBoard (ZU1.72), ITAC (P11.16)
B34_LN23: myirBoard (ZU1.80), ITAC (P11.19)
B34_LN24: myirBoard (ZU1.78), ITAC (P11.20)
B34_LP2: myirBoard (ZU1.27), ITAC (R20.1)
B34_LP5: myirBoard (ZU1.36), ITAC (P11.1)
B34_LP7: myirBoard (ZU1.40), ITAC (P11.3)
B34_LP10: myirBoard (ZU1.46), ITAC (P11.5)
B34_LP13: myirBoard (ZU1.50), ITAC (P11.7)
B34_LP15: myirBoard (ZU1.56), ITAC (P11.9)
B34_LP17: myirBoard (ZU1.60), ITAC (P11.11)
B34_LP18: myirBoard (ZU1.70), ITAC (P11.15)
B34_LP19: myirBoard (ZU1.64), ITAC (P11.13)
B34_LP21: myirBoard (ZU1.74), ITAC (P11.17)
B34_LP24: myirBoard (ZU1.76), ITAC (P11.18)
B35_LN1: myirBoard (Rp13.7), stepper (Rp11.7 U6.4)
B35_LN3: myirBoard (Rp13.5), stepper (Rp12.6 U6.15)
B35_LN5: myirBoard (Rp14.7), stepper (Rp9.7 U5.4)
B35_LN7: myirBoard (Rp14.5), stepper (Rp10.6 U5.15)
B35_LN9: myirBoard (Rp15.7), stepper (Rp7.7 U4.4)
B35_LN11: myirBoard (Rp15.5), stepper (Rp8.6 U4.15)
B35_LN13: myirBoard (Rp16.7), stepper (Rp5.7 U3.4)
B35_LN14: myirBoard (Rp19.2), stepper (Rp12.7 U6.13)
B35_LN15: myirBoard (Rp16.5), stepper (Rp6.6 U3.15)
B35_LN16: myirBoard (Rp19.4), stepper (Rp10.7 U5.13)
B35_LN17: myirBoard (Rp17.7), stepper (Rp3.7 U2.4)
B35_LN18: myirBoard (Rp20.2), stepper (Rp8.7 U4.13)
B35_LN19: myirBoard (Rp17.5), stepper (Rp4.6 U2.15)
B35_LN20: myirBoard (Rp20.4), stepper (Rp6.7 U3.13)
B35_LN21: myirBoard (Rp18.7), stepper (Rp1.7 U1.4)
B35_LN22: myirBoard (Rp21.2), stepper (Rp4.7 U2.13)
B35_LN23: myirBoard (Rp18.5), stepper (Rp2.6 U1.15)
B35_LN24: myirBoard (Rp21.4), stepper (Rp2.7 U1.13)
B35_LP1: myirBoard (Rp13.8), stepper (Rp11.6 U6.6)
B35_LP3: myirBoard (Rp13.6), stepper (Rp12.5 U6.17)
B35_LP5: myirBoard (Rp14.8), stepper (Rp9.6 U5.6)
B35_LP7: myirBoard (Rp14.6), stepper (Rp10.5 U5.17)
B35_LP9: myirBoard (Rp15.8), stepper (Rp7.6 U4.6)
B35_LP11: myirBoard (Rp15.6), stepper (Rp8.5 U4.17)
B35_LP13: myirBoard (Rp16.8), stepper (Rp5.6 U3.6)
B35_LP14: myirBoard (Rp19.1), stepper (Rp11.8 U6.2)
B35_LP15: myirBoard (Rp16.6), stepper (Rp6.5 U3.17)
B35_LP16: myirBoard (Rp19.3), stepper (Rp9.8 U5.2)
B35_LP17: myirBoard (Rp17.8), stepper (Rp3.6 U2.6)
B35_LP18: myirBoard (Rp20.1), stepper (Rp7.8 U4.2)
B35_LP19: myirBoard (Rp17.6), stepper (Rp4.5 U2.17)
B35_LP20: myirBoard (Rp20.3), stepper (Rp5.8 U3.2)
B35_LP21: myirBoard (Rp18.8), stepper (Rp1.6 U1.6)
B35_LP22: myirBoard (Rp21.1), stepper (Rp3.8 U2.2)
B35_LP23: myirBoard (Rp18.6), stepper (Rp2.5 U1.17)
B35_LP24: myirBoard (Rp21.3), stepper (Rp1.8 U1.2)